# EAGLE design VIC-MIDI_v0.1 (EAGLE 5.11)
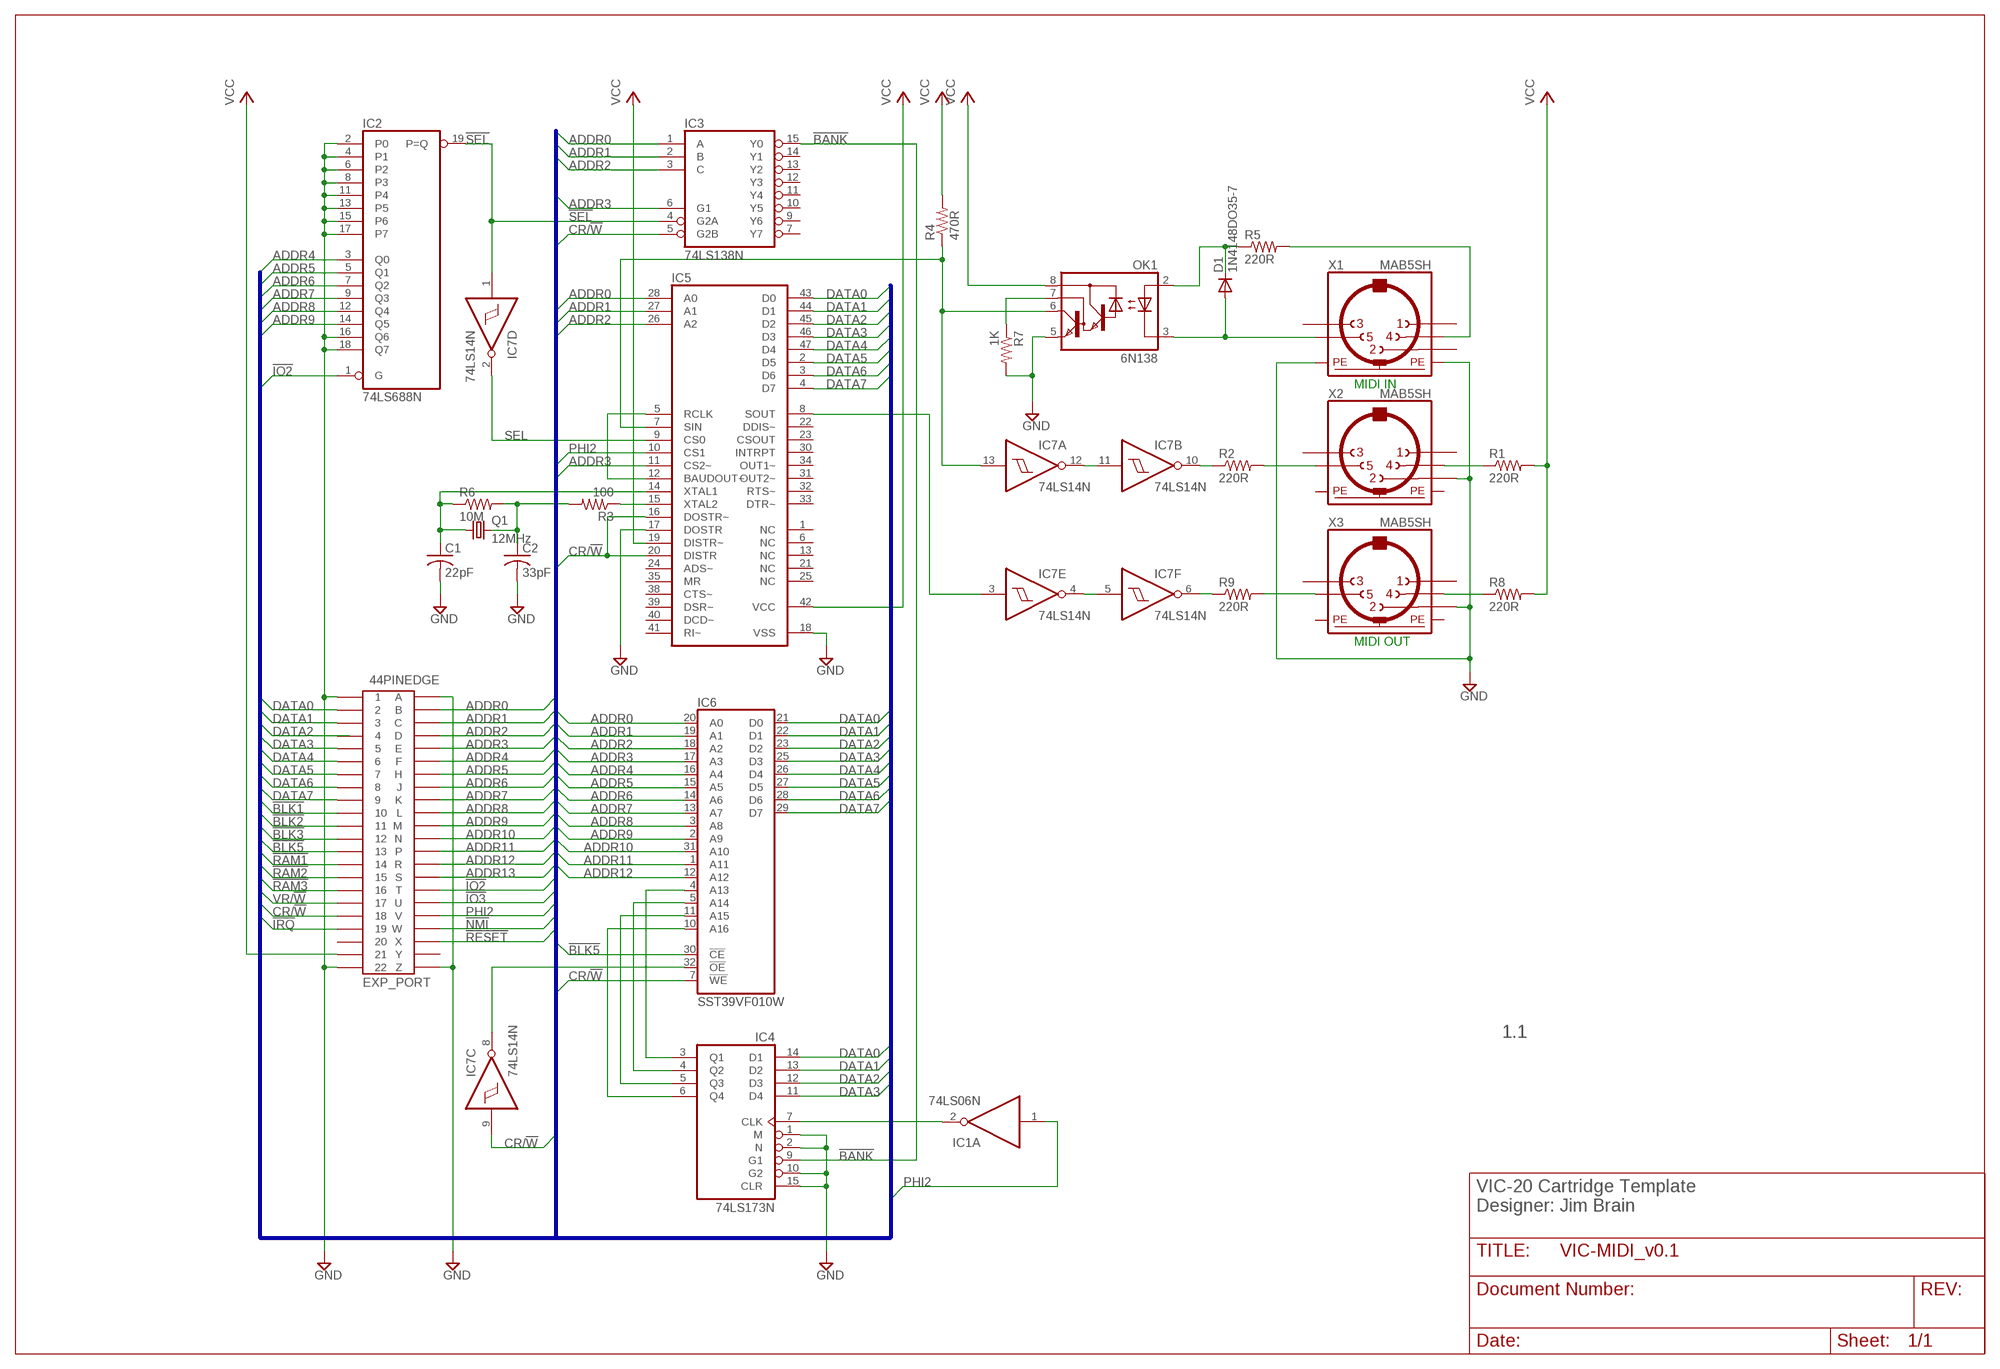
[diagram p0: schematic, sheet 1]

## Parts
44PINEDGE  EXP_PORT  MA-44  [MA-44]
C1  22pF  C-USC0805  [C0805]
C2  33pF  C-USC0805  [C0805]
D1  1N4148DO35-7  [DO35-7]
IC1  74LS06N  [DIL14]
IC2  74LS688N  [DIL20]
IC3  74LS138N  [DIL16]
IC4  74LS173N  [DIL16]
IC5  XR-16C450Q  [TQFP48]
IC6  SST39VF010W  [TSOP32]
IC7  74LS14N  [DIL14]
OK1  6N138  [DIL08]
Q1  12MHz  CRYSTALHC18U-V  [HC18U-V]
R1  220R  R-US_R0805  [R0805]
R2  220R  R-US_M0805  [M0805]
R3  100  R-US_R0805  [R0805]
R4  470R  R-US_R0805  [R0805]
R5  220R  R-US_M0805  [M0805]
R6  10M  R-US_R0805  [R0805]
R7  1K  R-US_R0805  [R0805]
R8  220R  R-US_R0805  [R0805]
R9  220R  R-US_M0805  [M0805]
X1  MAB5SH  [MAB5SH]
X2  MAB5SH  [MAB5SH]
X3  MAB5SH  [MAB5SH]

## Nets
!BANK: IC3.15(Y0) IC4.9(G1)
!BLK1: 44PINEDGE.10
!BLK2: 44PINEDGE.11
!BLK3: 44PINEDGE.12
!BLK5: 44PINEDGE.13 IC6.30(!CE)
!IO2: 44PINEDGE.T IC2.1(G)
!IO3: 44PINEDGE.U
!IRQ: 44PINEDGE.19
!NMI: 44PINEDGE.W
!RAM1: 44PINEDGE.14
!RAM2: 44PINEDGE.15
!RAM3: 44PINEDGE.16
!RESET: 44PINEDGE.X
!SEL: IC2.19(P=Q) IC3.4(G2A) IC7.1(D:I)
ADDR0: 44PINEDGE.B IC3.1(A) IC5.28(A0) IC6.20(A0)
ADDR1: 44PINEDGE.C IC3.2(B) IC5.27(A1) IC6.19(A1)
ADDR2: 44PINEDGE.D IC3.3(C) IC5.26(A2) IC6.18(A2)
ADDR3: 44PINEDGE.E IC3.6(G1) IC5.11(CS2~) IC6.17(A3)
ADDR4: 44PINEDGE.F IC2.3(Q0) IC6.16(A4)
ADDR5: 44PINEDGE.H IC2.5(Q1) IC6.15(A5)
ADDR6: 44PINEDGE.J IC2.7(Q2) IC6.14(A6)
ADDR7: 44PINEDGE.K IC2.9(Q3) IC6.13(A7)
ADDR8: 44PINEDGE.L IC2.12(Q4) IC6.3(A8)
ADDR9: 44PINEDGE.M IC2.14(Q5) IC6.2(A9)
ADDR10: 44PINEDGE.N IC6.31(A10)
ADDR11: 44PINEDGE.P IC6.1(A11)
ADDR12: 44PINEDGE.R IC6.12(A12)
ADDR13: 44PINEDGE.S
CR/!W: 44PINEDGE.18 IC3.5(G2B) IC5.16(DOSTR~) IC5.20(DISTR) IC7.9(C:I)
DATA0: 44PINEDGE.2 IC4.14(D1) IC5.43(D0) IC6.21(D0)
DATA1: 44PINEDGE.3 IC4.13(D2) IC5.44(D1) IC6.22(D1)
DATA2: 44PINEDGE.4 IC4.12(D3) IC5.45(D2) IC6.23(D2)
DATA3: 44PINEDGE.5 IC4.11(D4) IC5.46(D3) IC6.25(D3)
DATA4: 44PINEDGE.6 IC5.47(D4) IC6.26(D4)
DATA5: 44PINEDGE.7 IC5.2(D5) IC6.27(D5)
DATA6: 44PINEDGE.8 IC5.3(D6) IC6.28(D6)
DATA7: 44PINEDGE.9 IC5.4(D7) IC6.29(D7)
GND: 44PINEDGE.1 44PINEDGE.22 44PINEDGE.A 44PINEDGE.Z C1.2 C2.2 IC2.2(P0) IC2.4(P1) IC2.6(P2) IC2.8(P3) IC2.11(P4) IC2.13(P5) IC2.15(P6) IC2.16(Q6) IC2.17(P7) IC2.18(Q7) IC4.1(M) IC4.2(N) IC4.10(G2) IC4.15(CLR) IC5.17(DOSTR) IC5.18(VSS) OK1.5(GND) R7.2 X1.PE X1.PE@(PE) X2.2 X3.2
N$1: R9.2 X3.5
N$2: IC7.6(F:O) R9.1
N$3: R8.1 X3.4
N$4: IC7.4(E:O) IC7.5(F:I)
N$5: IC5.8(SOUT) IC7.3(E:I)
N$6: D1.C R5.1
N$7: R5.2 X1.4
N$8: D1.A OK1.3(C) X1.5
N$9: OK1.7(VB) R7.1
N$10: R2.2 X2.5
N$11: IC7.10(B:O) R2.1
N$12: IC7.11(B:I) IC7.12(A:O)
N$13: R1.1 X2.4
N$14: IC1.2(A:O) IC4.7(CLK)
N$15: IC5.15(XTAL2) R3.1
N$16: C1.1 IC5.14(XTAL1) Q1.1 R6.1
N$17: C2.1 Q1.2 R3.2 R6.2
N$18: IC4.4(Q2) IC6.5(A14)
N$19: IC5.5(RCLK) IC5.12(BAUDOUT~)
N$20: IC4.3(Q1) IC6.4(A13)
N$21: IC4.5(Q3) IC6.11(A15)
N$22: IC4.6(Q4) IC6.10(A16)
N$24: IC6.32(!OE) IC7.8(C:O)
N$25: IC5.7(SIN) IC7.13(A:I) OK1.6(VO) R4.1
PHI2: 44PINEDGE.V IC1.1(A:I) IC5.10(CS1)
SEL: IC5.9(CS0) IC7.2(D:O)
VCC: 44PINEDGE.21 IC5.19(DISTR~) IC5.42(VCC) OK1.8(VCC) R1.2 R4.2 R8.2
VR/!W: 44PINEDGE.17
Unconnected: 44PINEDGE.20 44PINEDGE.Y IC1.3(B:I) IC1.4(B:O) IC1.5(C:I) IC1.6(C:O) IC1.8(D:O) IC1.9(D:I) IC1.10(E:O) IC1.11(E:I) IC1.12(F:O) IC1.13(F:I) IC3.7(Y7) IC3.9(Y6) IC3.10(Y5) IC3.11(Y4) IC3.12(Y3) IC3.13(Y2) IC3.14(Y1) IC5.1(NC) IC5.6(NC) IC5.13(NC) IC5.21(NC) IC5.22(DDIS~) IC5.23(CSOUT) IC5.24(ADS~) IC5.25(NC) IC5.30(INTRPT) IC5.31(OUT2~) IC5.32(RTS~) IC5.33(DTR~) IC5.34(OUT1~) IC5.35(MR) IC5.38(CTS~) IC5.39(DSR~) IC5.40(DCD~) IC5.41(RI~) IC6.7(!WE) OK1.2(A) X1.1 X1.2 X1.3 X2.1 X2.3 X3.1 X3.3

## Buses
DATA[0..7],ADDR[0..13],VR/!W,CR/!W,!BLK1,!BLK2,!BLK3,!BLK5,!RAM1,!RAM2,!RAM3,!IRQ,!NMI,!IO2,!IO3,PHI2,!RESET

## Notes on the sheet
- MIDI IN
- MIDI OUT
- 1.1
- VIC-20 Cartridge Template
- Designer: Jim Brain

## Power pins joined to a net without a drawn wire
GND: IC1.7(P:GND) IC2.10(GND) IC3.8(GND) IC4.8(GND) IC6.24(GND) IC7.7(P:GND)
PE: X2.PE X2.PE@(PE) X3.PE X3.PE@(PE)
VCC: IC1.14(P:VCC) IC2.20(VCC) IC3.16(VCC) IC4.16(VCC) IC6.8(VCC) IC7.14(P:VCC)

## Library data of the parts
44PINEDGE = con-edge-156:MA-44: 44 PIN EDGE CONNECTOR FOR PCB
C1 C2 = rcl:C-US: CAPACITOR, American symbol
D1 = diode:1N4148: DIODE high speed (Philips)
IC1 = 74xx-us:74*06: Hex INVERTER, open collector high-voltage output
IC2 = 74xx-us:74*688: 8-bit MAGNITUDE/IDENTITY COMPARATOR, totem pole
IC3 = 74xx-us:74*138: 3-line to 8-line DECODER/DEMULTIPLEXER
IC4 = 74xx-us:74*173: 4-bit D type REGISTER, 3-state
IC5 = exar:XR-16C450Q: UART
IC6 = memory:SST39VF010: 1 Mbit x8 Multi-Purpose Flash Source: http://www.sst.com/dotAsset/40782.pdf
IC7 = 74xx-us:74*14: Hex schmitt trigger INVERTER
OK1 = optocoupler:6N138: MOTOROLA OPTO COUPLER; MF: VISHAY/TELEFUNKEN; MPN: 6N138; OC_FARNELL: 9860150; OC_NEWARK: 35K5294
Q1 = crystal:CRYSTAL: CRYSTAL
R1-R9 = resistor:R-US_: RESISTOR, American symbol
X1-X3 = con-hirschmann:MAB5SH: Female CONNECTOR 5 pins 90 deg. with shield, horizontal (DIN 41524)

## Board
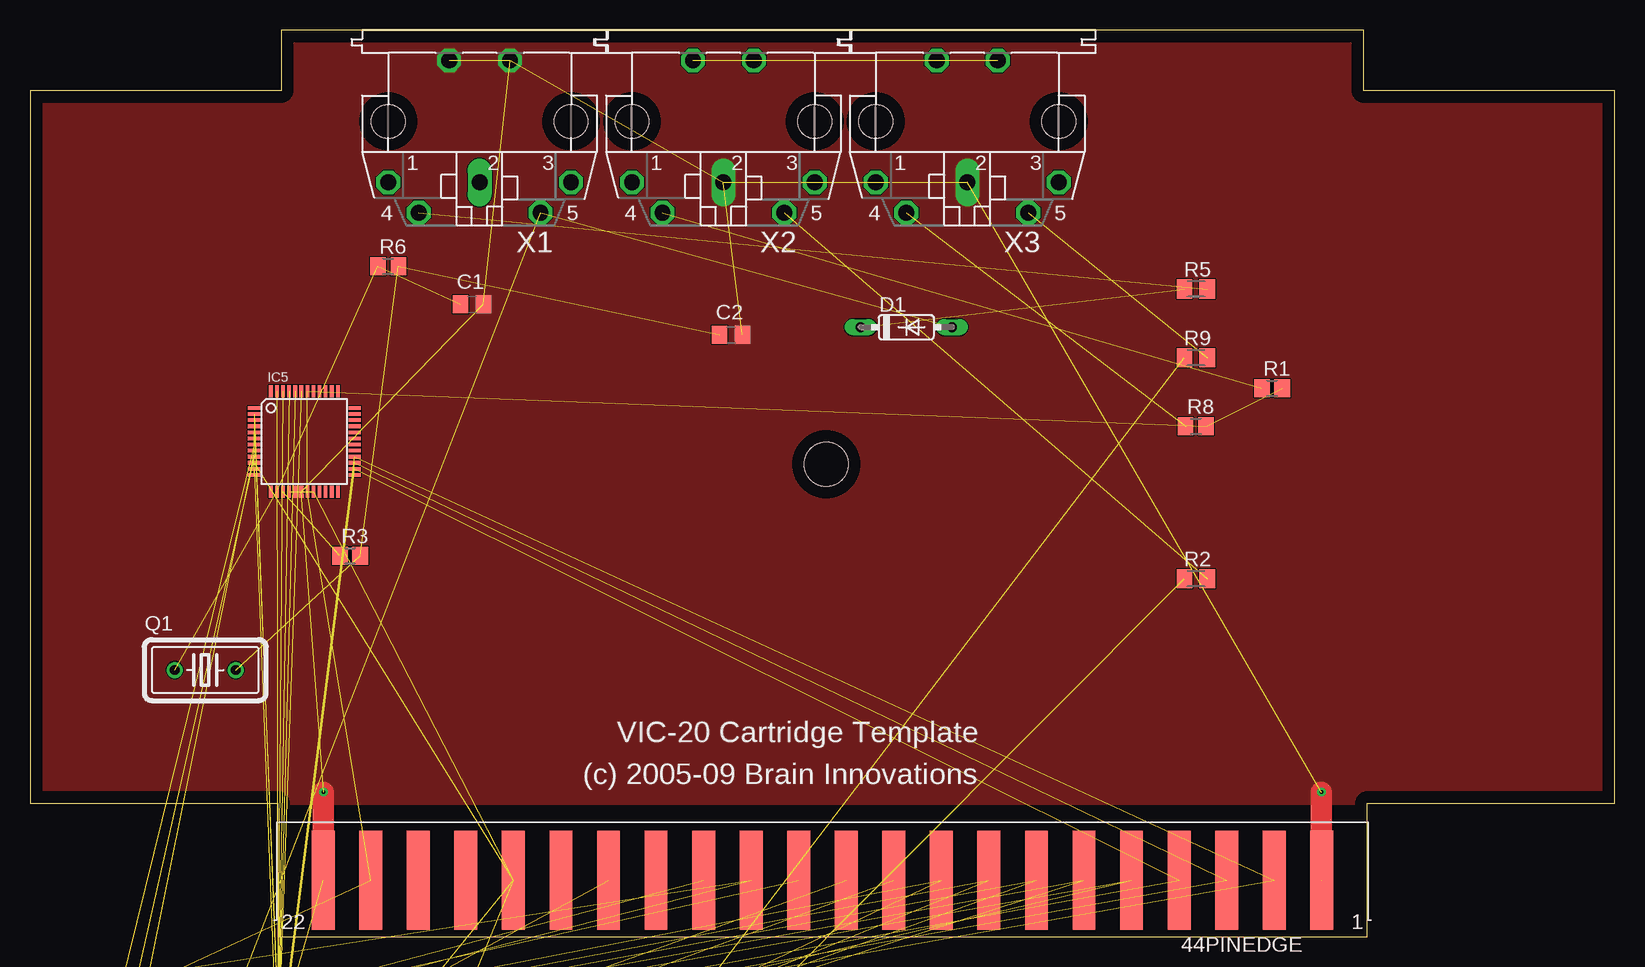
[diagram p1: board, top side]
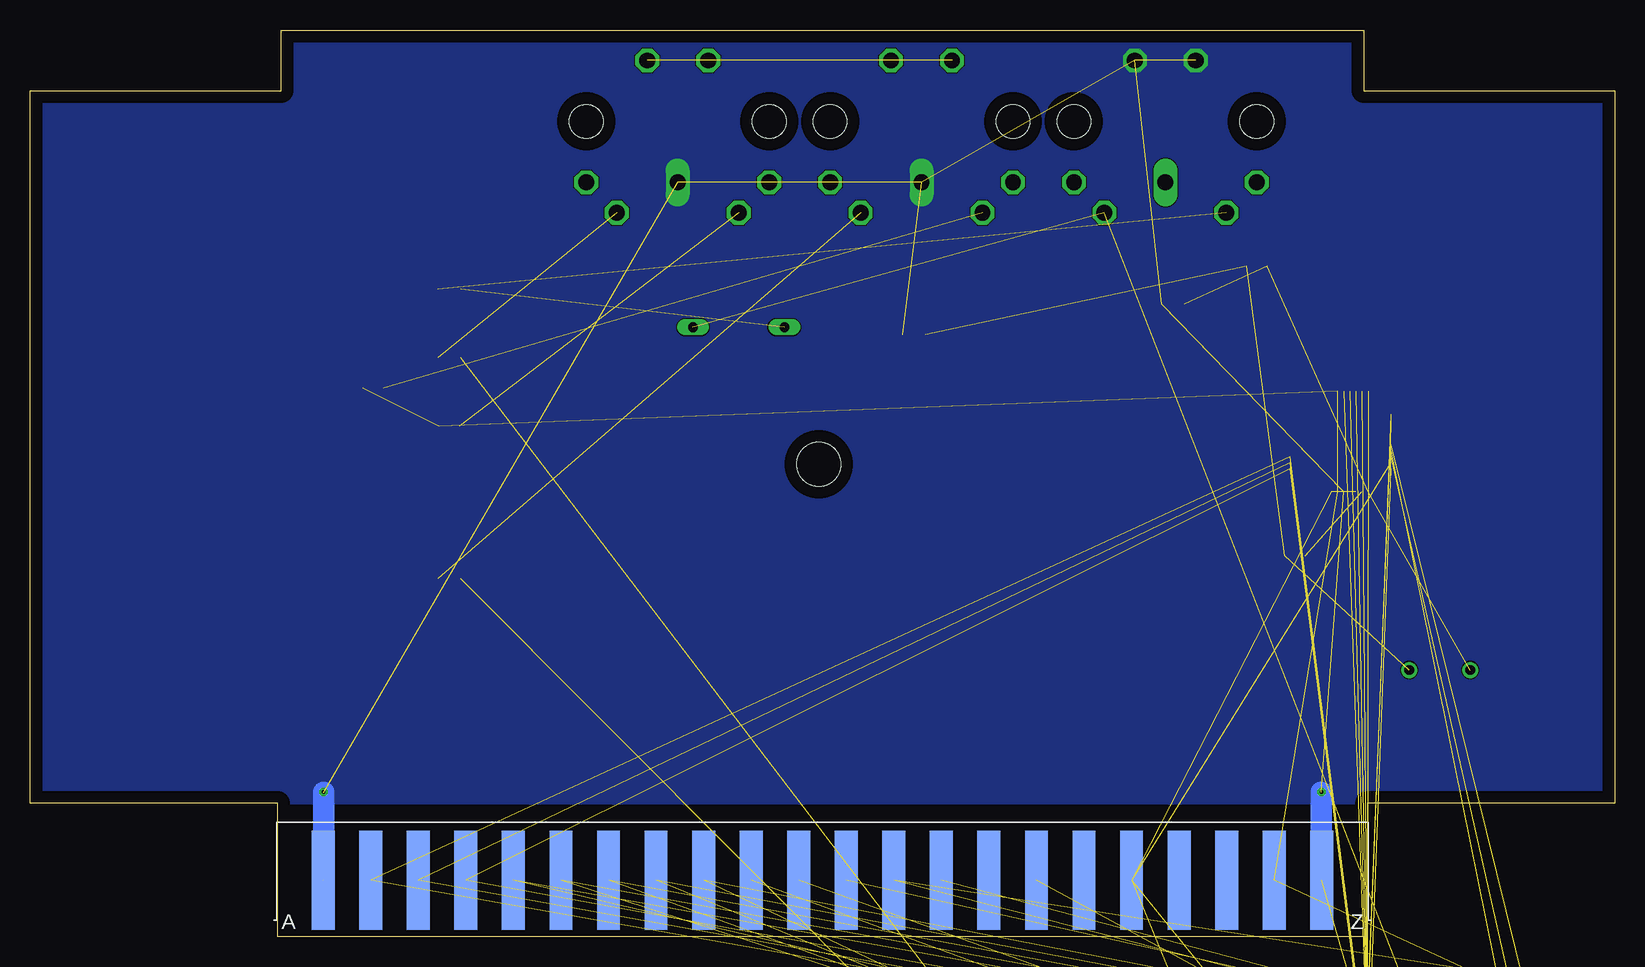
[diagram p2: board, bottom side, seen from below]

Size 132.08 x 75.56 mm. Coordinates in mm from the lower left corner, seen from the top.
Outline: 20.64,0 111.44,0 111.44,11.11 132.08,11.11 132.08,70.48 111.12,70.48 111.12,75.56 20.95,75.56 20.95,70.48 0,70.48 0,11.11 20.64,11.11 20.64,0
Copper layers (1*16): Top 0.035mm / dielectric 1.5mm / Bottom 0.035mm
Design rules "ourpcb-small": minimum track width 4mil, minimum drill 12mil, track to track 4mil, track to pad 4mil, pad to pad 4mil, via to via 4mil, smd to smd 0mil, copper to edge 40mil, drill to drill 8mil, minimum pad ring 10mil, minimum via ring 8mil, stop-mask expansion 4mil, vias tented up to drill 0mil, thermal gap 10mil
Holes 3.64 mm at 66.36,39.37

### Footprints (pad centres in the part's own frame; a part is rotated, then mirrored left to right if it is on the bottom)
MA-44 = smd 1.905 x 8.255: 1 -41.605,4.826; 2 -37.643,4.826; 3 -33.68,4.826; 4 -29.718,4.826; 5 -25.756,4.826; 6 -21.793,4.826; 7 -17.831,4.826; 8 -13.868,4.826; 9 -9.906,4.826; 10 -5.944,4.826; 11 -1.981,4.826; 12 1.981,4.826; 13 5.944,4.826; 14 9.906,4.826; 15 13.868,4.826; 16 17.831,4.826; 17 21.793,4.826; 18 25.756,4.826; 19 29.718,4.826; 20 33.68,4.826; 21 37.643,4.826; 22 41.605,4.826 | smd 1.905 x 8.255 bottom: A -41.605,4.826; B -37.643,4.826; C -33.68,4.826; D -29.718,4.826; E -25.756,4.826; F -21.793,4.826; H -17.831,4.826; J -13.868,4.826; K -9.906,4.826; L -5.944,4.826; M -1.981,4.826; N 1.981,4.826; P 5.944,4.826; R 9.906,4.826; S 13.868,4.826; T 17.831,4.826; U 21.793,4.826; V 25.756,4.826; W 29.718,4.826; X 33.68,4.826; Y 37.643,4.826; Z 41.605,4.826
C0805 = smd 1.3 x 1.5: 1 -0.95,0; 2 0.95,0
DO35-7 = drill 0.813 long: A 3.81,0; C -3.81,0
DIL14 = drill 0.813 long: 1 -7.62,-3.81; 2 -5.08,-3.81; 3 -2.54,-3.81; 4 0,-3.81; 5 2.54,-3.81; 6 5.08,-3.81; 7 7.62,-3.81; 8 7.62,3.81; 9 5.08,3.81; 10 2.54,3.81; 11 0,3.81; 12 -2.54,3.81; 13 -5.08,3.81; 14 -7.62,3.81
DIL20 = drill 0.813 long: 1 -11.43,-3.81; 2 -8.89,-3.81; 3 -6.35,-3.81; 4 -3.81,-3.81; 5 -1.27,-3.81; 6 1.27,-3.81; 7 3.81,-3.81; 8 6.35,-3.81; 9 8.89,-3.81; 10 11.43,-3.81; 11 11.43,3.81; 12 8.89,3.81; 13 6.35,3.81; 14 3.81,3.81; 15 1.27,3.81; 16 -1.27,3.81; 17 -3.81,3.81; 18 -6.35,3.81; 19 -8.89,3.81; 20 -11.43,3.81
DIL16 = drill 0.813 long: 1 -8.89,-3.81; 2 -6.35,-3.81; 3 -3.81,-3.81; 4 -1.27,-3.81; 5 1.27,-3.81; 6 3.81,-3.81; 7 6.35,-3.81; 8 8.89,-3.81; 9 8.89,3.81; 10 6.35,3.81; 11 3.81,3.81; 12 1.27,3.81; 13 -1.27,3.81; 14 -3.81,3.81; 15 -6.35,3.81; 16 -8.89,3.81
TQFP48 = smd 1.016 x 0.305: 1 -4.191,2.794; 2 -4.191,2.286; 3 -4.191,1.778; 4 -4.191,1.27; 5 -4.191,0.762; 6 -4.191,0.254; 7 -4.191,-0.254; 8 -4.191,-0.762; 9 -4.191,-1.27; 10 -4.191,-1.778; 11 -4.191,-2.286; 12 -4.191,-2.794; 25 4.191,-2.794; 26 4.191,-2.286; 27 4.191,-1.778; 28 4.191,-1.27; 29 4.191,-0.762; 30 4.191,-0.254; 31 4.191,0.254; 32 4.191,0.762; 33 4.191,1.27; 34 4.191,1.778; 35 4.191,2.286; 36 4.191,2.794 | smd 0.305 x 1.016: 13 -2.794,-4.191; 14 -2.286,-4.191; 15 -1.778,-4.191; 16 -1.27,-4.191; 17 -0.762,-4.191; 18 -0.254,-4.191; 19 0.254,-4.191; 20 0.762,-4.191; 21 1.27,-4.191; 22 1.778,-4.191; 23 2.286,-4.191; 24 2.794,-4.191; 37 2.794,4.191; 38 2.286,4.191; 39 1.778,4.191; 40 1.27,4.191; 41 0.762,4.191; 42 0.254,4.191; 43 -0.254,4.191; 44 -0.762,4.191; 45 -1.27,4.191; 46 -1.778,4.191; 47 -2.286,4.191; 48 -2.794,4.191
TSOP32 = smd 1.2 x 0.36: 1 -9.85,3.75; 2 -9.85,3.25; 3 -9.85,2.75; 4 -9.85,2.25; 5 -9.85,1.75; 6 -9.85,1.25; 7 -9.85,0.75; 8 -9.85,0.25; 9 -9.85,-0.25; 10 -9.85,-0.75; 11 -9.85,-1.25; 12 -9.85,-1.75; 13 -9.85,-2.25; 14 -9.85,-2.75; 15 -9.85,-3.25; 16 -9.85,-3.75; 17 9.85,-3.75; 18 9.85,-3.25; 19 9.85,-2.75; 20 9.85,-2.25; 21 9.85,-1.75; 22 9.85,-1.25; 23 9.85,-0.75; 24 9.85,-0.25; 25 9.85,0.25; 26 9.85,0.75; 27 9.85,1.25; 28 9.85,1.75; 29 9.85,2.25; 30 9.85,2.75; 31 9.85,3.25; 32 9.85,3.75
DIL08 = drill 0.813 offset: 1 -3.81,-3.81; 2 -1.27,-3.81; 3 1.27,-3.81; 4 3.81,-3.81; 5 3.81,3.81; 6 1.27,3.81; 7 -1.27,3.81; 8 -3.81,3.81
HC18U-V = drill 0.813 round: 1 -2.54,0; 2 2.54,0
R0805 = smd 1.3 x 1.5: 1 -0.85,0; 2 0.85,0
M0805 = smd 1.3 x 1.6: 1 -0.95,0; 2 0.95,0
MAB5SH = drill 1.321 octagon: 1 7.62,5.08; 3 -7.62,5.08; 4 5.08,7.62; 5 -5.08,7.62; PE -2.54,-5.08; PE@ 2.54,-5.08 | drill 1.321 long: 2 0,5.08 | hole 2.794: 7.62,0; -7.62,0

### Placement (x,y rotation side)
44PINEDGE  66.04,9.53 180 top
C1  36.83,52.7 0 top
C2  58.42,50.16 0 top
D1  73.02,50.8 0 top
IC1  -25.4,-81.92 0 top  (outside the outline)
IC2  8.89,-19.05 0 top  (outside the outline)
IC3  12.06,-57.15 0 top  (outside the outline)
IC4  12.06,-44.45 0 top  (outside the outline)
IC5  22.86,41.27 0 top
IC6  10.79,-8.26 0 top  (outside the outline)
IC7  -1.91,-69.85 0 top  (outside the outline)
OK1  -5.71,-56.52 0 top  (outside the outline)
Q1  14.61,22.23 0 top
R1  103.5,45.72 0 top
R2  97.16,29.84 0 top
R3  26.67,31.75 0 top
R4  -34.92,-73.03 0 top  (outside the outline)
R5  97.16,53.98 0 top
R6  29.84,55.88 0 top
R7  -17.15,-73.03 0 top  (outside the outline)
R8  97.16,42.55 0 top
R9  97.16,48.26 0 top
X1  37.46,67.94 180 top
X2  57.79,67.94 180 top
X3  78.1,67.94 180 top

### Tracks (layer width: path | path; a pad name or v marks a point on that pad's centre or on a via)
!BANK  (1 unrouted)
!BLK5  (1 unrouted)
!IO2  (1 unrouted)
!SEL  (2 unrouted)
ADDR0  (3 unrouted)
ADDR1  (3 unrouted)
ADDR2  (3 unrouted)
ADDR3  (3 unrouted)
ADDR4  (2 unrouted)
ADDR5  (2 unrouted)
ADDR6  (2 unrouted)
ADDR7  (2 unrouted)
ADDR8  (2 unrouted)
ADDR9  (2 unrouted)
ADDR10  (1 unrouted)
ADDR11  (1 unrouted)
ADDR12  (1 unrouted)
CR/!W  (4 unrouted)
DATA0  (3 unrouted)
DATA1  (3 unrouted)
DATA2  (3 unrouted)
DATA3  (3 unrouted)
DATA4  (2 unrouted)
DATA5  (2 unrouted)
DATA6  (2 unrouted)
DATA7  (2 unrouted)
GND  (via drill 0.3)  (34 unrouted)
  Top 1.778: 44PINEDGE.A v107.62,12.06 | 44PINEDGE.22 24.45,4.7 v24.45,12.06
  Bottom 1.778: 44PINEDGE.A v107.62,12.06 | 44PINEDGE.22 v24.46,12.06
  pour Top (no thermals): 20.95,75.56 20.95,70.48 0,70.48 0,11.11 132.08,11.11 132.08,70.48 111.12,70.48 111.12,75.56
  pour Bottom (no thermals): 0,11.11 132.08,11.11 132.08,70.48 111.12,70.48 111.12,75.56 20.95,75.56 20.95,70.48 0,70.48
N$1  (1 unrouted)
N$2  (1 unrouted)
N$3  (1 unrouted)
N$4  (1 unrouted)
N$5  (1 unrouted)
N$6  (1 unrouted)
N$7  (1 unrouted)
N$8  (2 unrouted)
N$9  (1 unrouted)
N$10  (1 unrouted)
N$11  (1 unrouted)
N$12  (1 unrouted)
N$13  (1 unrouted)
N$14  (1 unrouted)
N$15  (1 unrouted)
N$16  (3 unrouted)
N$17  (3 unrouted)
N$18  (1 unrouted)
N$19  (1 unrouted)
N$20  (1 unrouted)
N$21  (1 unrouted)
N$22  (1 unrouted)
N$24  (1 unrouted)
N$25  (3 unrouted)
PE  (3 unrouted)
PHI2  (2 unrouted)
SEL  (1 unrouted)
VCC  (12 unrouted)

### Text on the board
tPlace: VIC-20 Cartridge Template | (c) 2005-09 Brain Innovations